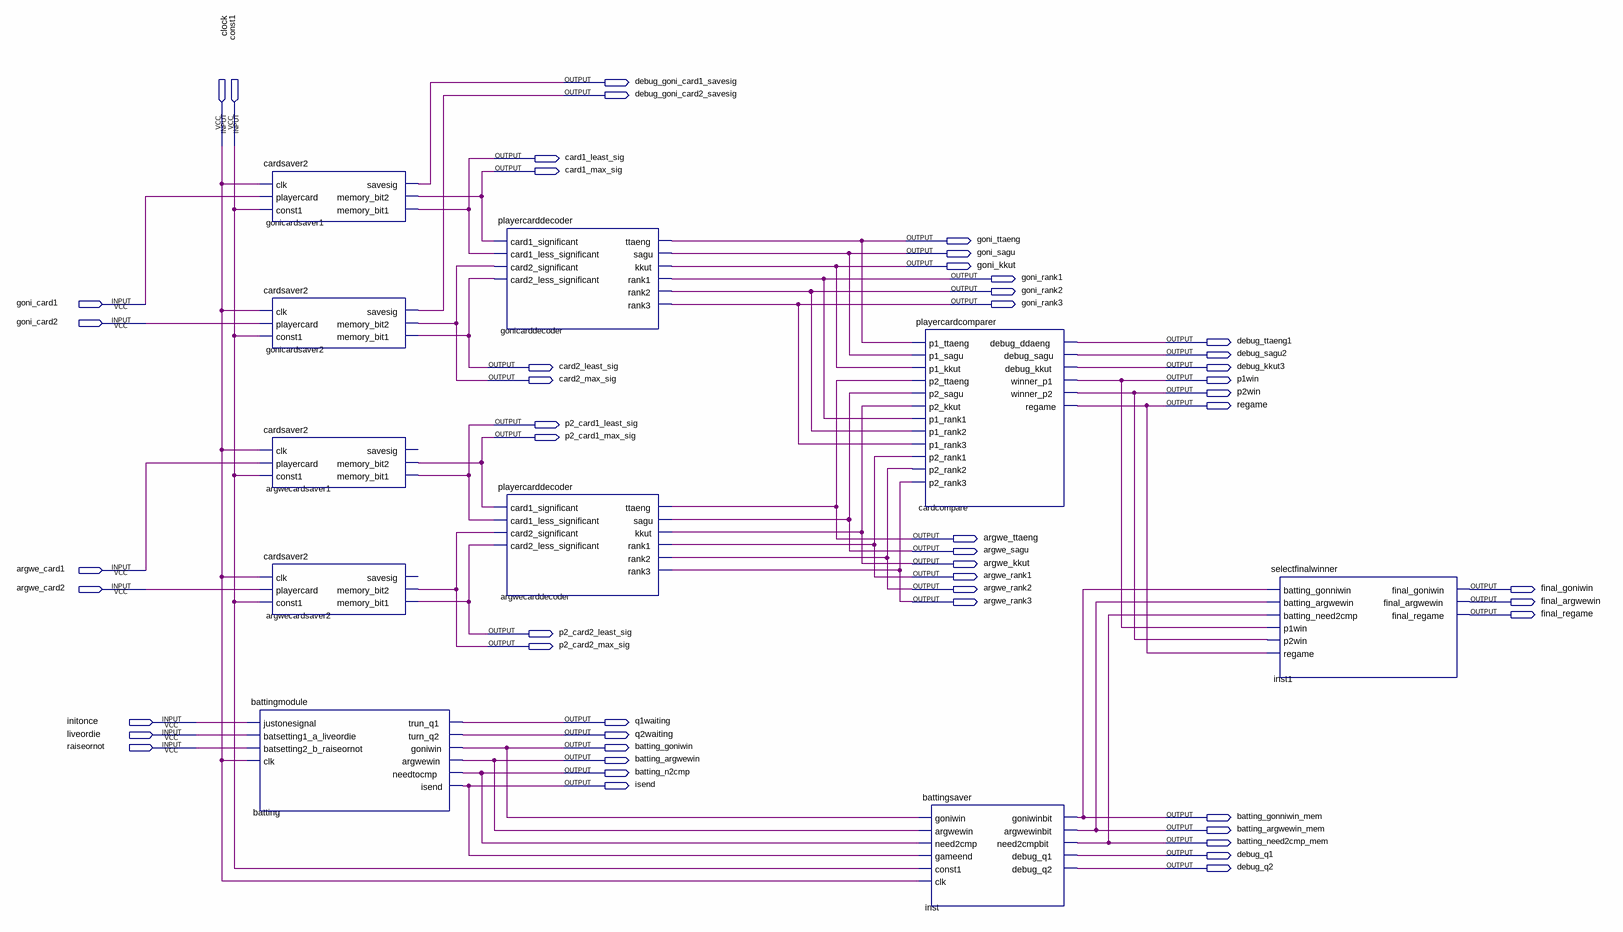
[diagram p0: schematic sheet]
// Quartus schematic Assignment.bdf as structural Verilog: 10 symbols, 51 pins
module Assignment (
  input  clock,
  input  const1,
  input  goni_card1,
  input  goni_card2,
  input  argwe_card1,
  input  argwe_card2,
  input  initonce,
  input  liveordie,
  input  raiseornot,
  output debug_goni_card1_savesig,
  output debug_goni_card2_savesig,
  output card1_least_sig,
  output card1_max_sig,
  output goni_ttaeng,
  output goni_sagu,
  output goni_kkut,
  output goni_rank1,
  output goni_rank2,
  output goni_rank3,
  output debug_ttaeng1,
  output debug_sagu2,
  output card2_least_sig,
  output debug_kkut3,
  output card2_max_sig,
  output p1win,
  output p2win,
  output regame,
  output p2_card1_least_sig,
  output p2_card1_max_sig,
  output argwe_ttaeng,
  output argwe_sagu,
  output argwe_kkut,
  output argwe_rank1,
  output argwe_rank2,
  output final_goniwin,
  output argwe_rank3,
  output final_argwewin,
  output final_regame,
  output p2_card2_least_sig,
  output p2_card2_max_sig,
  output q1waiting,
  output q2waiting,
  output batting_goniwin,
  output batting_argwewin,
  output batting_n2cmp,
  output isend,
  output batting_gonniwin_mem,
  output batting_argwewin_mem,
  output batting_need2cmp_mem,
  output debug_q1,
  output debug_q2
);

  cardsaver2 gonicardsaver1 (
    .clk(clock), .playercard(goni_card1), .const1(const1), .savesig(debug_goni_card1_savesig),
    .memory_bit2(card1_max_sig), .memory_bit1(card1_least_sig));
  cardsaver2 gonicardsaver2 (
    .clk(clock), .playercard(goni_card2), .const1(const1), .savesig(debug_goni_card2_savesig),
    .memory_bit2(card2_max_sig), .memory_bit1(card2_least_sig));
  cardsaver2 argwecardsaver1 (
    .clk(clock), .playercard(argwe_card1), .const1(const1), .memory_bit2(p2_card1_max_sig),
    .memory_bit1(p2_card1_least_sig));  // open: savesig
  cardsaver2 argwecardsaver2 (
    .clk(clock), .playercard(argwe_card2), .const1(const1), .memory_bit2(p2_card2_max_sig),
    .memory_bit1(p2_card2_least_sig));  // open: savesig
  battingmodule batting (
    .justonesignal(initonce), .batsetting1_a_liveordie(liveordie), .batsetting2_b_raiseornot(raiseornot),
    .clk(clock), .trun_q1(q1waiting), .turn_q2(q2waiting), .goniwin(batting_goniwin),
    .argwewin(batting_argwewin), .needtocmp(batting_n2cmp), .isend(isend));
  playercarddecoder gonicarddecoder (
    .card1_significant(card1_max_sig), .card1_less_significant(card1_least_sig),
    .card2_significant(card2_max_sig), .card2_less_significant(card2_least_sig), .ttaeng(goni_ttaeng),
    .sagu(goni_sagu), .kkut(goni_kkut), .rank1(goni_rank1), .rank2(goni_rank2), .rank3(goni_rank3));
  playercarddecoder argwecarddecoder (
    .card1_significant(p2_card1_max_sig), .card1_less_significant(p2_card1_least_sig),
    .card2_significant(p2_card2_max_sig), .card2_less_significant(p2_card2_least_sig), .ttaeng(argwe_ttaeng),
    .sagu(argwe_sagu), .kkut(argwe_kkut), .rank1(argwe_rank1), .rank2(argwe_rank2), .rank3(argwe_rank3));
  playercardcomparer cardcompare (
    .p1_ttaeng(goni_ttaeng), .p1_sagu(goni_sagu), .p1_kkut(goni_kkut), .p2_ttaeng(argwe_ttaeng),
    .p2_sagu(argwe_sagu), .p2_kkut(argwe_kkut), .p1_rank1(goni_rank1), .p1_rank2(goni_rank2),
    .p1_rank3(goni_rank3), .p2_rank1(argwe_rank1), .p2_rank2(argwe_rank2), .p2_rank3(argwe_rank3),
    .debug_ddaeng(debug_ttaeng1), .debug_sagu(debug_sagu2), .debug_kkut(debug_kkut3), .winner_p1(p1win),
    .winner_p2(p2win), .regame(regame));
  battingsaver inst (
    .goniwin(batting_goniwin), .argwewin(batting_argwewin), .need2cmp(batting_n2cmp), .gameend(isend),
    .const1(const1), .clk(clock), .goniwinbit(batting_gonniwin_mem), .argwewinbit(batting_argwewin_mem),
    .need2cmpbit(batting_need2cmp_mem), .debug_q1(debug_q1), .debug_q2(debug_q2));
  selectfinalwinner inst1 (
    .batting_gonniwin(batting_gonniwin_mem), .batting_argwewin(batting_argwewin_mem),
    .batting_need2cmp(batting_need2cmp_mem), .p1win(p1win), .p2win(p2win), .regame(regame),
    .final_goniwin(final_goniwin), .final_argwewin(final_argwewin), .final_regame(final_regame));
endmodule
